# Altium schematic sheet TILaunchpad.SchDoc
size A
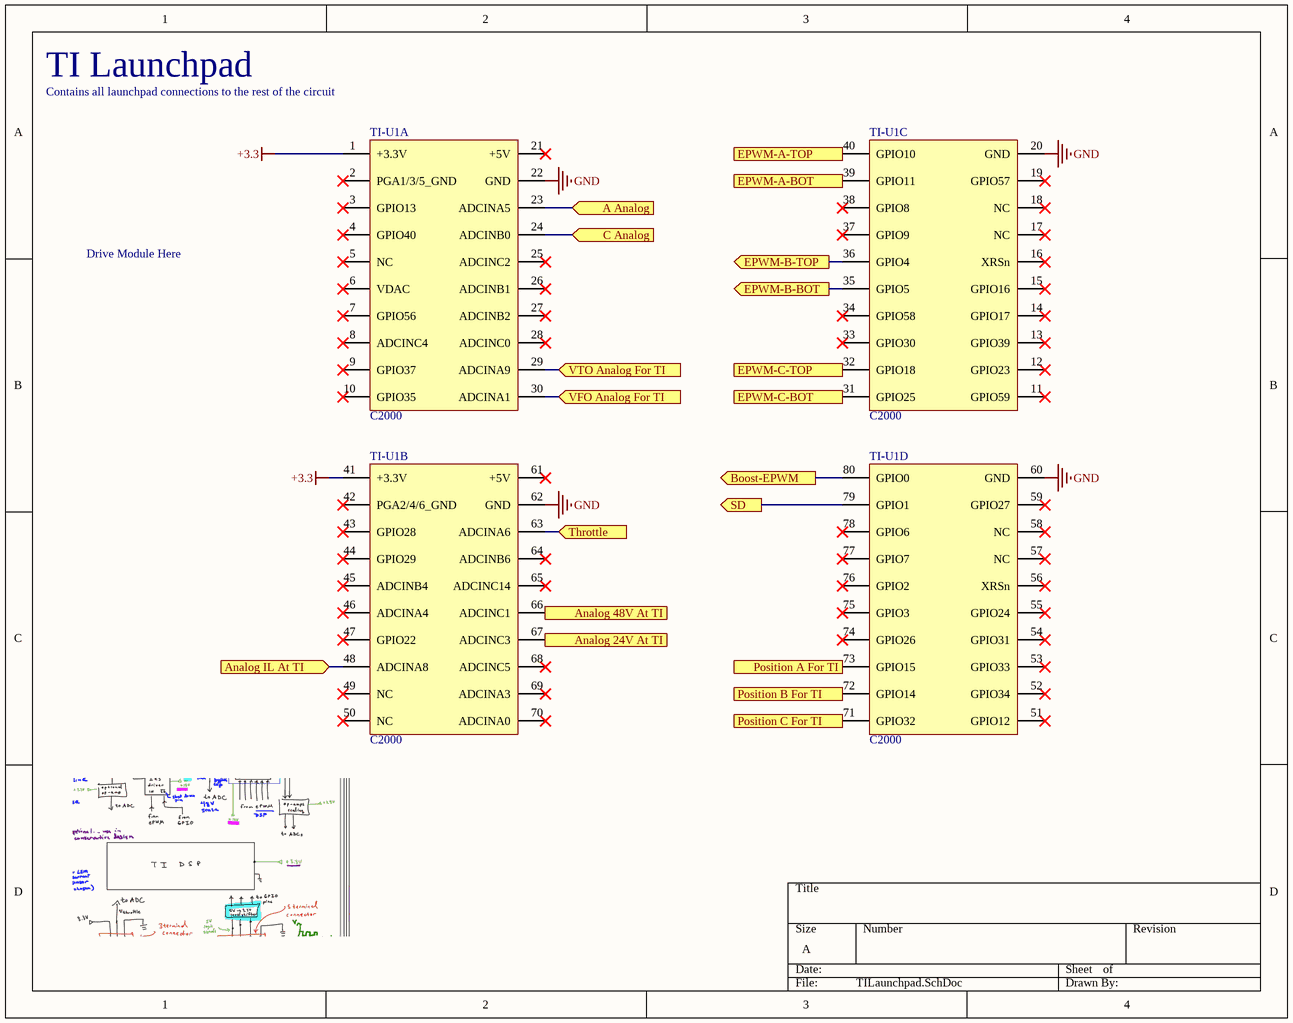
[diagram p0: TILaunchpad.SchDoc]

## Parts
TI-U1  C2000  [C2000]  (parts A,B,C,D of 4)

## Ports
A Analog (in), Analog 24V At TI (in), Analog 48V At TI (in), Analog IL At TI (in), Boost-EPWM (out), C Analog (in), EPWM-A-BOT (out), EPWM-A-TOP (out), EPWM-B-BOT (out), EPWM-B-TOP (out), EPWM-C-BOT (out), EPWM-C-TOP (out), Position A For TI (in), Position B For TI (in), Position C For TI (in), SD (out), Throttle (in), VFO Analog For TI (in), VTO Analog For TI (in)

## Nets
+3.3: TI-U1.1(+3.3V) TI-U1.41(+3.3V)
GND: TI-U1.20(GND) TI-U1.22(GND) TI-U1.60(GND) TI-U1.62(GND)
A Analog: TI-U1.23(ADCINA5) ; port A Analog
Analog 24V At TI: TI-U1.67(ADCINC3) ; port Analog 24V At TI
Analog 48V At TI: TI-U1.66(ADCINC1) ; port Analog 48V At TI
Analog IL At TI: TI-U1.48(ADCINA8) ; port Analog IL At TI
Boost-EPWM: TI-U1.80(GPIO0) ; port Boost-EPWM
C Analog: TI-U1.24(ADCINB0) ; port C Analog
EPWM-A-BOT: TI-U1.39(GPIO11) ; port EPWM-A-BOT
EPWM-A-TOP: TI-U1.40(GPIO10) ; port EPWM-A-TOP
EPWM-B-BOT: TI-U1.35(GPIO5) ; port EPWM-B-BOT
EPWM-B-TOP: TI-U1.36(GPIO4) ; port EPWM-B-TOP
EPWM-C-BOT: TI-U1.31(GPIO25) ; port EPWM-C-BOT
EPWM-C-TOP: TI-U1.32(GPIO18) ; port EPWM-C-TOP
Position A For TI: TI-U1.73(GPIO15) ; port Position A For TI
Position B For TI: TI-U1.72(GPIO14) ; port Position B For TI
Position C For TI: TI-U1.71(GPIO32) ; port Position C For TI
SD: TI-U1.79(GPIO1) ; port SD
Throttle: TI-U1.63(ADCINA6) ; port Throttle
VFO Analog For TI: TI-U1.30(ADCINA1) ; port VFO Analog For TI
VTO Analog For TI: TI-U1.29(ADCINA9) ; port VTO Analog For TI

Not connected (* = marked no-connect by the designer): TI-U1 2(PGA1/3/5_GND)* 3(GPIO13)* 4(GPIO40)* 5(NC)* 6(VDAC)* 7(GPIO56)* 8(ADCINC4)* 9(GPIO37)* 10(GPIO35)* 11(GPIO59)* 12(GPIO23)* 13(GPIO39)* 14(GPIO17)* 15(GPIO16)* 16(XRSn)* 17(NC)* 18(NC)* 19(GPIO57)* 21(+5V)* 25(ADCINC2)* 26(ADCINB1)* 27(ADCINB2)* 28(ADCINC0)* 33(GPIO30)* 34(GPIO58)* 37(GPIO9)* 38(GPIO8)* 42(PGA2/4/6_GND)* 43(GPIO28)* 44(GPIO29)* 45(ADCINB4)* 46(ADCINA4)* 47(GPIO22)* 49(NC)* 50(NC)* 51(GPIO12)* 52(GPIO34)* 53(GPIO33)* 54(GPIO31)* 55(GPIO24)* 56(XRSn)* 57(NC)* 58(NC)* 59(GPIO27)* 61(+5V)* 64(ADCINB6)* 65(ADCINC14)* 68(ADCINC5)* 69(ADCINA3)* 70(ADCINA0)* 74(GPIO26)* 75(GPIO3)* 76(GPIO2)* 77(GPIO7)* 78(GPIO6)*

## Notes on the sheet
- TI Launchpad
- Contains all launchpad connections to the rest of the circuit
- Drive Module Here

## Library data of the parts
TI-U1 = C2000: F280049C; Parameter 1: test 2